# Altium schematic sheet GPIO.SchDoc: GPIO
size Letter; Engineer: Prasoon Sinha; DocumentNumber: 4; Revision: v1.2; SheetNumber: 4; SheetTotal: 26
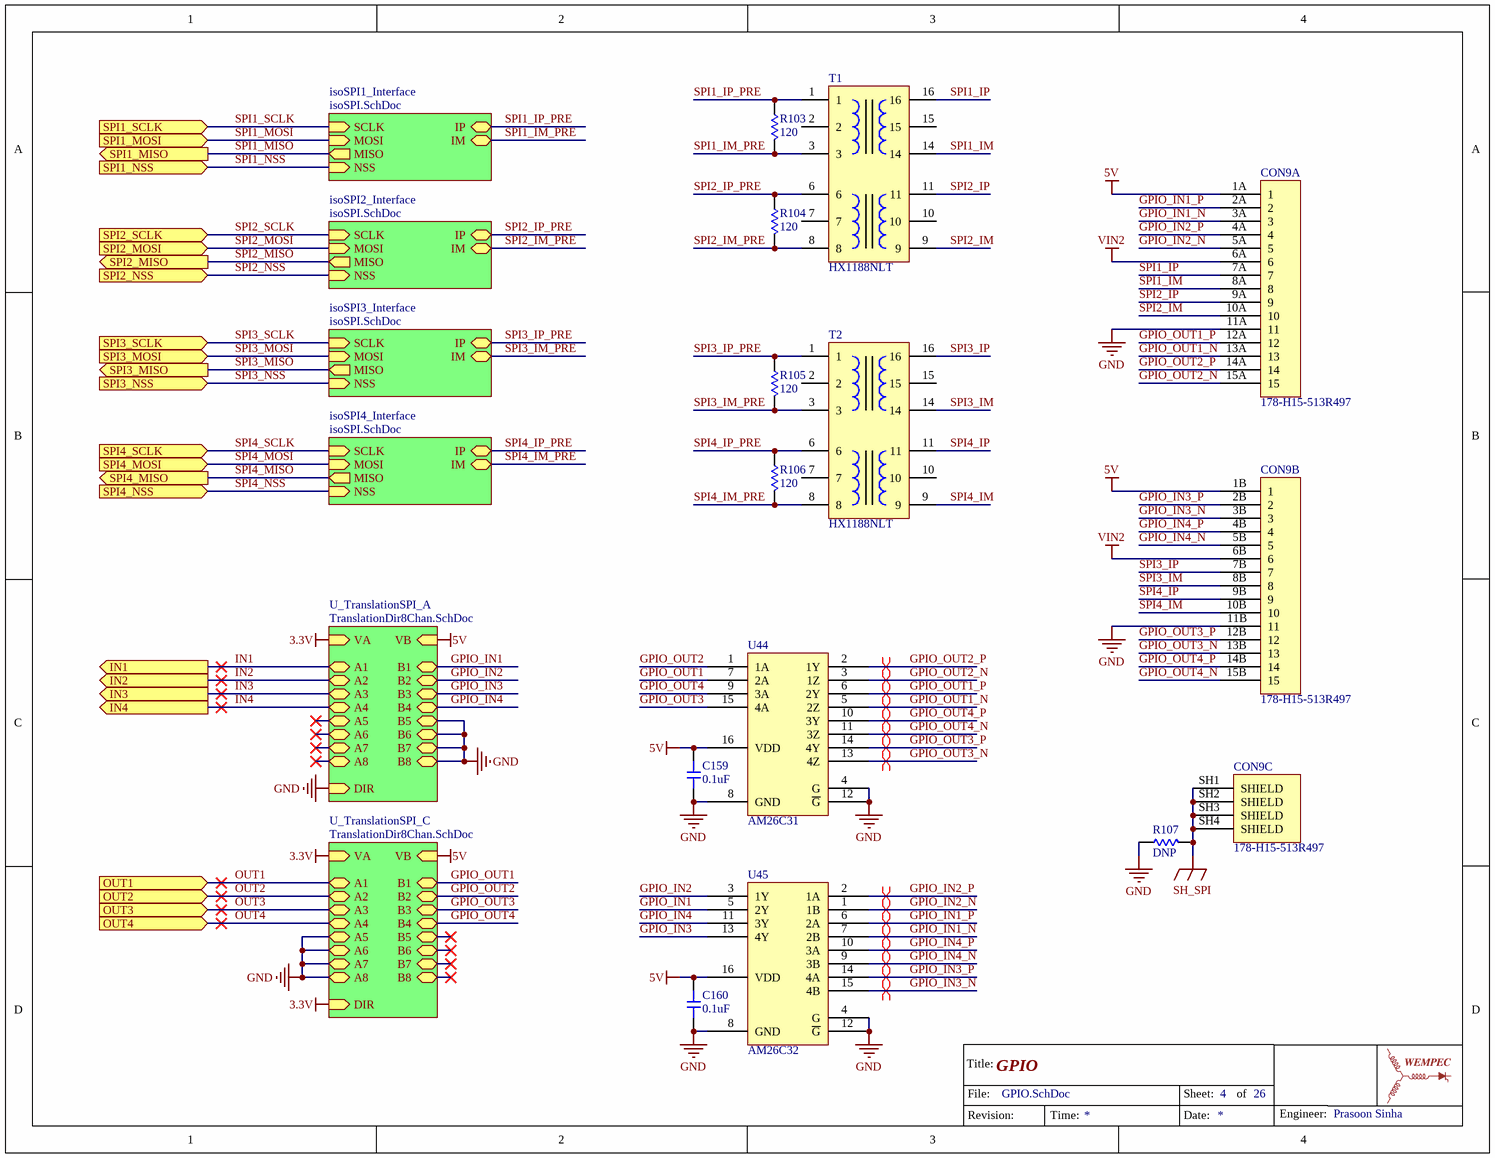
[diagram p0: GPIO.SchDoc]

## Parts
C159  value 0.1uF  [0603-CAP]  (hidden comment: Capacitor)
C160  value 0.1uF  [0603-CAP]  (hidden comment: Capacitor)
CON9  178-H15-513R497  [178-H15-513R497]  (parts A,B,C of 3)
R103  value 120  [0603-RES]  (hidden comment: Resistor)
R104  value 120  [0603-RES]  (hidden comment: Resistor)
R105  value 120  [0603-RES]  (hidden comment: Resistor)
R106  value 120  [0603-RES]  (hidden comment: Resistor)
R107  value DNP  [0603-RES]  (hidden comment: Resistor)
T1  HX1188NLT  [HX1188NLT]
T2  HX1188NLT  [HX1188NLT]
U44  AM26C31  [TSOP65P640X120-16N]
U45  AM26C32  [TSOP65P640X120-16N]

## Sub-sheets
isoSPI1_Interface = isoSPI.SchDoc: IM (bidir), IP (bidir), NSS (in), MOSI (in), SCLK (in), MISO (out)
isoSPI2_Interface = isoSPI.SchDoc: IM (bidir), IP (bidir), NSS (in), MOSI (in), SCLK (in), MISO (out)
isoSPI3_Interface = isoSPI.SchDoc: IM (bidir), IP (bidir), NSS (in), MOSI (in), SCLK (in), MISO (out)
isoSPI4_Interface = isoSPI.SchDoc: IM (bidir), IP (bidir), NSS (in), MOSI (in), SCLK (in), MISO (out)
U_TranslationSPI_A = TranslationDir8Chan.SchDoc: VB (in), VA (in), B1 (bidir), B2 (bidir), B3 (bidir), B4 (bidir), B5 (bidir), B6 (bidir), B7 (bidir), B8 (bidir), A1 (bidir), A2 (bidir), A3 (bidir), A4 (bidir), A5 (bidir), A6 (bidir), A7 (bidir), A8 (bidir), DIR (in)
U_TranslationSPI_C = TranslationDir8Chan.SchDoc: VB (in), VA (in), B1 (bidir), B2 (bidir), B3 (bidir), B4 (bidir), B5 (bidir), B6 (bidir), B7 (bidir), B8 (bidir), A1 (bidir), A2 (bidir), A3 (bidir), A4 (bidir), A5 (bidir), A6 (bidir), A7 (bidir), A8 (bidir), DIR (in)

## Ports
IN1 (out), IN2 (out), IN3 (out), IN4 (out), OUT1 (in), OUT2 (in), OUT3 (in), OUT4 (in), SPI1_MISO (out), SPI1_MOSI (in), SPI1_NSS (in), SPI1_SCLK (in), SPI2_MISO (out), SPI2_MOSI (in), SPI2_NSS (in), SPI2_SCLK (in), SPI3_MISO (out), SPI3_MOSI (in), SPI3_NSS (in), SPI3_SCLK (in), SPI4_MISO (out), SPI4_MOSI (in), SPI4_NSS (in), SPI4_SCLK (in)

## Nets
3.3V: sheet U_TranslationSPI_A/VA, sheet U_TranslationSPI_C/VA, sheet U_TranslationSPI_C/DIR
5V: C159.1 C160.1 CON9.1A(1) CON9.1B(1) U44.16(VDD) U45.16(VDD) ; sheet U_TranslationSPI_A/VB, sheet U_TranslationSPI_C/VB
GND: C159.2 C160.2 CON9.11A(11) CON9.11B(11) R107.1 U44.4(G) U44.8(GND) U44.12(~{G}) U45.4(G) U45.8(GND) U45.12(~{G}) ; sheet U_TranslationSPI_A/B5, sheet U_TranslationSPI_A/B6, sheet U_TranslationSPI_A/B7, sheet U_TranslationSPI_A/B8, sheet U_TranslationSPI_A/DIR, sheet U_TranslationSPI_C/A5, sheet U_TranslationSPI_C/A6, sheet U_TranslationSPI_C/A7, sheet U_TranslationSPI_C/A8
SH_SPI: CON9.SH1(SHIELD) CON9.SH2(SHIELD) CON9.SH3(SHIELD) CON9.SH4(SHIELD) R107.2
VIN2: CON9.6A(6) CON9.6B(6)
GPIO_IN1: U45.5(2Y) ; sheet U_TranslationSPI_A/B1
GPIO_IN1_N: CON9.3A(3) U45.7(2B)
GPIO_IN1_P: CON9.2A(2) U45.6(2A)
GPIO_IN2: U45.3(1Y) ; sheet U_TranslationSPI_A/B2
GPIO_IN2_N: CON9.5A(5) U45.1(1B)
GPIO_IN2_P: CON9.4A(4) U45.2(1A)
GPIO_IN3: U45.13(4Y) ; sheet U_TranslationSPI_A/B3
GPIO_IN3_N: CON9.3B(3) U45.15(4B)
GPIO_IN3_P: CON9.2B(2) U45.14(4A)
GPIO_IN4: U45.11(3Y) ; sheet U_TranslationSPI_A/B4
GPIO_IN4_N: CON9.5B(5) U45.9(3B)
GPIO_IN4_P: CON9.4B(4) U45.10(3A)
GPIO_OUT1: U44.7(2A) ; sheet U_TranslationSPI_C/B1
GPIO_OUT1_N: CON9.13A(13) U44.5(2Z)
GPIO_OUT1_P: CON9.12A(12) U44.6(2Y)
GPIO_OUT2: U44.1(1A) ; sheet U_TranslationSPI_C/B2
GPIO_OUT2_N: CON9.15A(15) U44.3(1Z)
GPIO_OUT2_P: CON9.14A(14) U44.2(1Y)
GPIO_OUT3: U44.15(4A) ; sheet U_TranslationSPI_C/B3
GPIO_OUT3_N: CON9.13B(13) U44.13(4Z)
GPIO_OUT3_P: CON9.12B(12) U44.14(4Y)
GPIO_OUT4: U44.9(3A) ; sheet U_TranslationSPI_C/B4
GPIO_OUT4_N: CON9.15B(15) U44.11(3Z)
GPIO_OUT4_P: CON9.14B(14) U44.10(3Y)
IN1: port IN1, sheet U_TranslationSPI_A/A1
IN2: port IN2, sheet U_TranslationSPI_A/A2
IN3: port IN3, sheet U_TranslationSPI_A/A3
IN4: port IN4, sheet U_TranslationSPI_A/A4
OUT1: port OUT1, sheet U_TranslationSPI_C/A1
OUT2: port OUT2, sheet U_TranslationSPI_C/A2
OUT3: port OUT3, sheet U_TranslationSPI_C/A3
OUT4: port OUT4, sheet U_TranslationSPI_C/A4
SPI1_IM: CON9.8A(8) T1.14
SPI1_IM_PRE: R103.2 T1.3 ; sheet isoSPI1_Interface/IM
SPI1_IP: CON9.7A(7) T1.16
SPI1_IP_PRE: R103.1 T1.1 ; sheet isoSPI1_Interface/IP
SPI1_MISO: port SPI1_MISO, sheet isoSPI1_Interface/MISO
SPI1_MOSI: port SPI1_MOSI, sheet isoSPI1_Interface/MOSI
SPI1_NSS: port SPI1_NSS, sheet isoSPI1_Interface/NSS
SPI1_SCLK: port SPI1_SCLK, sheet isoSPI1_Interface/SCLK
SPI2_IM: CON9.10A(10) T1.9
SPI2_IM_PRE: R104.2 T1.8 ; sheet isoSPI2_Interface/IM
SPI2_IP: CON9.9A(9) T1.11
SPI2_IP_PRE: R104.1 T1.6 ; sheet isoSPI2_Interface/IP
SPI2_MISO: port SPI2_MISO, sheet isoSPI2_Interface/MISO
SPI2_MOSI: port SPI2_MOSI, sheet isoSPI2_Interface/MOSI
SPI2_NSS: port SPI2_NSS, sheet isoSPI2_Interface/NSS
SPI2_SCLK: port SPI2_SCLK, sheet isoSPI2_Interface/SCLK
SPI3_IM: CON9.8B(8) T2.14
SPI3_IM_PRE: R105.2 T2.3 ; sheet isoSPI3_Interface/IM
SPI3_IP: CON9.7B(7) T2.16
SPI3_IP_PRE: R105.1 T2.1 ; sheet isoSPI3_Interface/IP
SPI3_MISO: port SPI3_MISO, sheet isoSPI3_Interface/MISO
SPI3_MOSI: port SPI3_MOSI, sheet isoSPI3_Interface/MOSI
SPI3_NSS: port SPI3_NSS, sheet isoSPI3_Interface/NSS
SPI3_SCLK: port SPI3_SCLK, sheet isoSPI3_Interface/SCLK
SPI4_IM: CON9.10B(10) T2.9
SPI4_IM_PRE: R106.2 T2.8 ; sheet isoSPI4_Interface/IM
SPI4_IP: CON9.9B(9) T2.11
SPI4_IP_PRE: R106.1 T2.6 ; sheet isoSPI4_Interface/IP
SPI4_MISO: port SPI4_MISO, sheet isoSPI4_Interface/MISO
SPI4_MOSI: port SPI4_MOSI, sheet isoSPI4_Interface/MOSI
SPI4_NSS: port SPI4_NSS, sheet isoSPI4_Interface/NSS
SPI4_SCLK: port SPI4_SCLK, sheet isoSPI4_Interface/SCLK

Not connected (* = marked no-connect by the designer): T1 2 7 10 15; T2 2 7 10 15

## Layout directives
differential pair: GPIO_IN1_N, GPIO_IN1_P, GPIO_IN2_N, GPIO_IN2_P, GPIO_IN3_N, GPIO_IN3_P, GPIO_IN4_N, GPIO_IN4_P, GPIO_OUT1_N, GPIO_OUT1_P, GPIO_OUT2_N, GPIO_OUT2_P, GPIO_OUT3_N, GPIO_OUT3_P, GPIO_OUT4_N, GPIO_OUT4_P

## Notes on the sheet
- Title:
- File:
- Sheet:
- of
- Revision:
- Time:
- Date:
- Engineer:

## Library data of the parts
CON9 = 178-H15-513R497: CONN D-SUB RCPT/RCPT 15/15POS RA; Supplier 1: Digi-Key; Supplier Part Number 1: NOR1832-ND
T1 T2 = HX1188NLT: XFRMR MAGNETIC 1PORT 1:1 10/100; Supplier 1: Digi-Key; Supplier Part Number 1: 553-1536-1-ND
U44 = AM26C31: IC DRIVER 4/0 16TSSOP; Supplier 1: Digi-Key; Supplier Part Number 1: 296-30087-1-ND
U45 = AM26C32: IC RCVR RS422 QUAD DIFF 16TSSOP; Supplier 1: Digi-Key; Supplier Part Number 1: 296-30088-1-ND
C159 C160 = Capacitor: Supplier 1: Digi-Key; Supplier Part Number 1: 1276-1012-1-ND
R103-R107 = Resistor: Supplier 1: Digi-Key
  R103-R106: Supplier Part Number 1: 311-120HRCT-ND
  R107: Supplier Part Number 1: P0.0GCT-ND